# EAGLE design visualization_breakout_2_port (EAGLE 6.4)
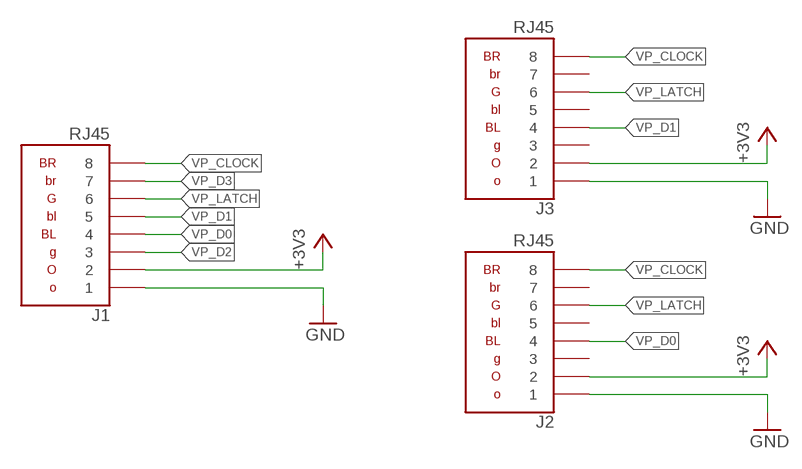
[diagram p0: schematic, sheet 1]

## Parts
J1  RJ45  [RJ45]
J2  RJ45  [RJ45]
J3  RJ45  [RJ45]

## Nets
+3V3: J1.2 J2.2 J3.2
GND: J1.1 J2.1 J3.1
VP_CLOCK: J1.8 J2.8 J3.8
VP_D0: J1.4 J2.4
VP_D1: J1.5 J3.4
VP_D2: J1.3
VP_D3: J1.7
VP_LATCH: J1.6 J2.6 J3.6
Unconnected: J2.3 J2.5 J2.7 J3.3 J3.5 J3.7

## Library data of the parts
J1-J3 = TASLink:RJ45

## Board
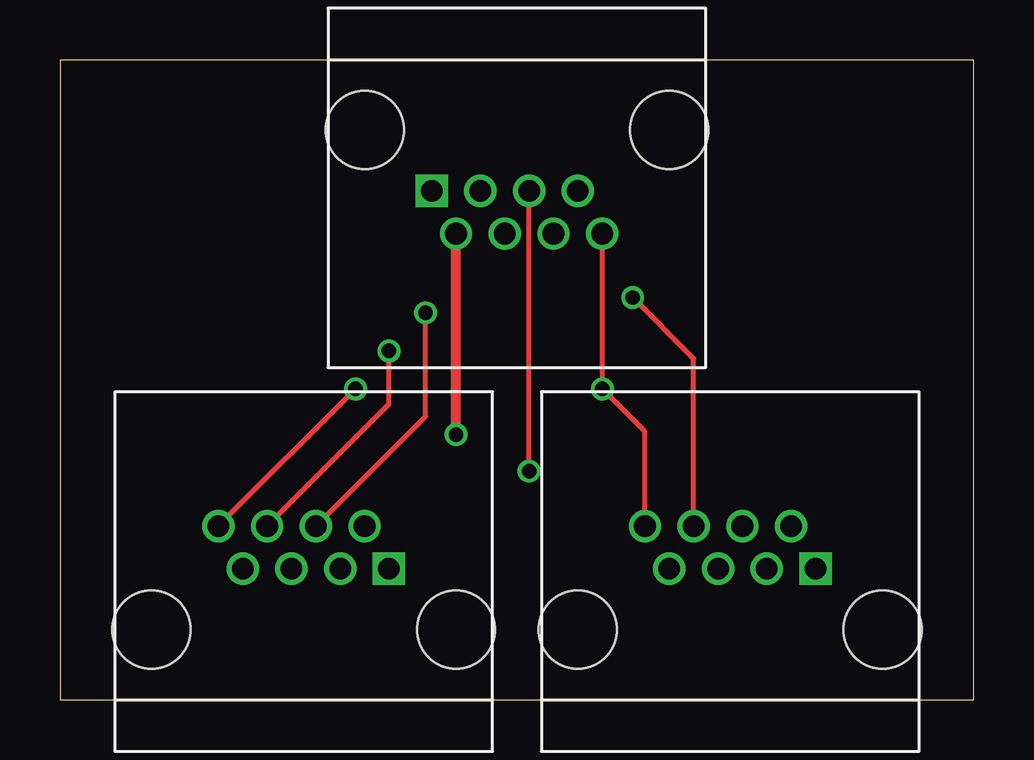
[diagram p1: board, top side]
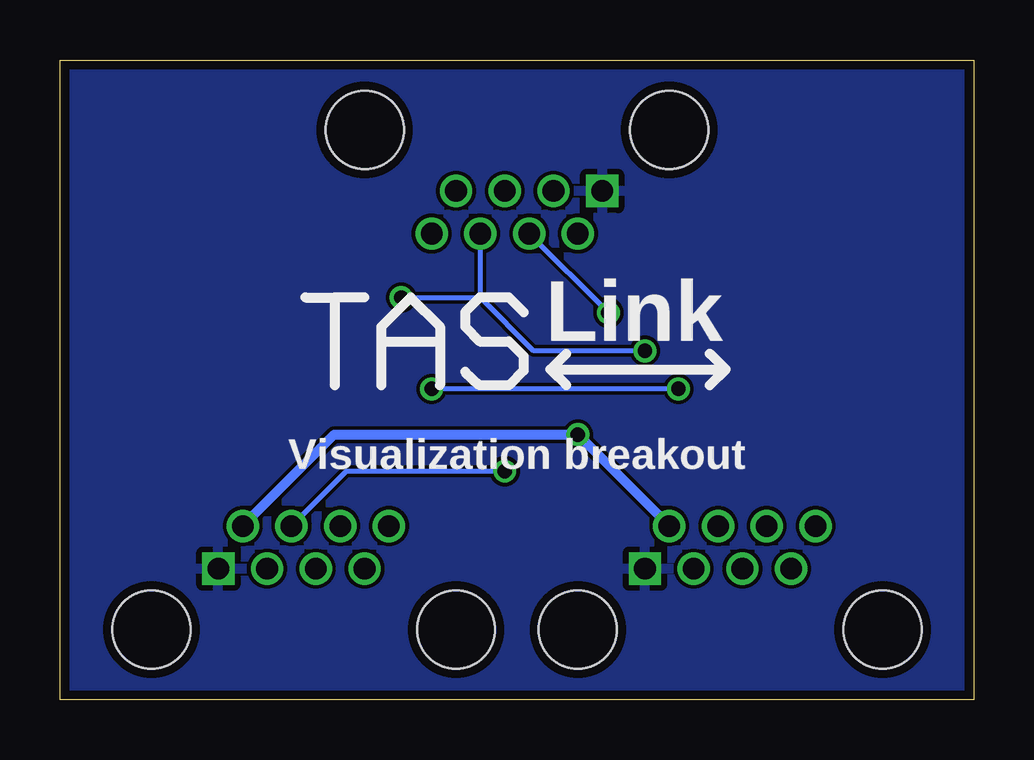
[diagram p2: board, bottom side, seen from below]

Size 38.1 x 26.67 mm. Coordinates in mm from the lower left corner, seen from the top.
Outline: 0,0 38.1,0 38.1,26.67 0,26.67 0,0
Copper layers (1*16): Top 0.0356mm / dielectric 1.5011mm / Bottom 0.0356mm
Design rules "LaenPCBOrder *": minimum track width 6mil, minimum drill 13mil, track to track 6mil, track to pad 6mil, pad to pad 6mil, via to via 6mil, smd to smd 6mil, copper to edge 15mil, drill to drill 6mil, minimum pad ring 7mil, minimum via ring 7mil, stop-mask expansion 3mil, vias tented up to drill 24mil, thermal gap 10mil

### Footprints (pad centres in the part's own frame; a part is rotated, then mirrored left to right if it is on the bottom)
RJ45 = drill 0.9 square: 1 3.556,-0.889 | drill 0.9: 2 2.54,0.889; 3 1.524,-0.889; 4 0.508,0.889; 5 -0.508,-0.889; 6 -1.524,0.889; 7 -2.54,-0.889; 8 -3.556,0.889 | hole 3.251: -6.35,-3.429; 6.35,-3.429

### Placement (x,y rotation side)
J1  19.05,20.32 180 top
J2  10.16,6.35 0 top
J3  27.94,6.35 0 top

### Tracks (layer width: path | path; a pad name or v marks a point on that pad's centre or on a via)
+3V3  (via drill 0.6)
  Top 0.406: v16.51,11.05 J1.2
  Bottom 0.406: J2.2 v16.51,11.05 26.67,11.05 J3.2
GND
  pour Bottom: 0,26.67 38.1,26.67 38.1,0 0,0
VP_CLOCK  (via drill 0.6)
  Top 0.203: J1.8 v22.61,12.95 24.38,11.18 J3.8 | J2.8 v12.32,12.95
  Bottom 0.203: v12.32,12.95 v22.61,12.95
VP_D0  (via drill 0.6)
  Top 0.203: J2.4 15.24,11.81 v15.24,16.13
  Bottom 0.203: v15.24,16.13 J1.4
VP_D1  (via drill 0.6)
  Top 0.203: v19.56,9.53 J1.5
  Bottom 0.203: J3.4 26.16,9.53 v19.56,9.53
VP_LATCH  (via drill 0.6)
  Top 0.203: J2.6 13.72,12.32 v13.72,14.54 | J3.6 26.42,14.22 v23.88,16.76
  Bottom 0.203: 20.57,16.76 J1.6 | v23.88,16.76 20.57,16.76 | v13.72,14.54 18.35,14.54 20.57,16.76

### Text on the board
bPlace: Link | Visualization breakout